# Altium schematic sheet IC304.schdoc
size 92 x 83 mm
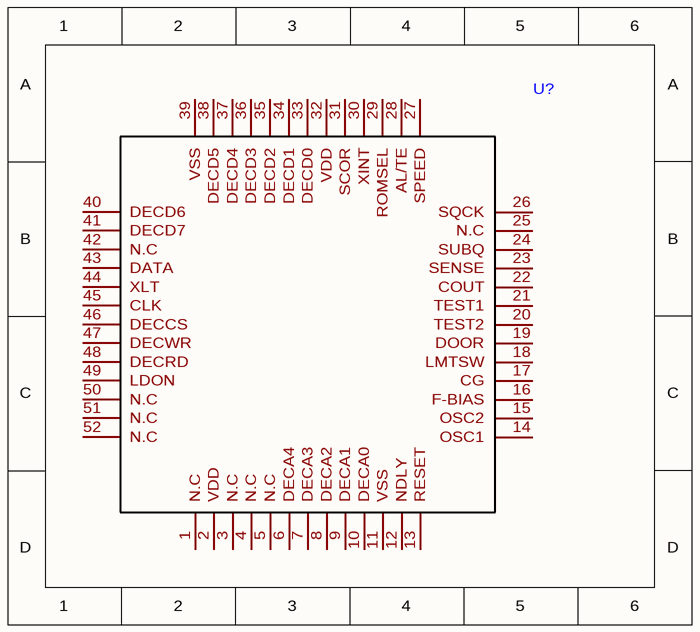
[diagram p0: IC304.schdoc]

## Parts
U?  (no value)  [LQFP-52_L10.0-W10.0-P0.65-LS12.0-BL]

## Nets

Not connected (* = marked no-connect by the designer): U? 1(N.C) 2(VDD) 3(N.C) 4(N.C) 5(N.C) 6(DECA4) 7(DECA3) 8(DECA2) 9(DECA1) 10(DECA0) 11(VSS) 12(NDLY) 13(RESET) 14(OSC1) 15(OSC2) 16(F-BIAS) 17(CG) 18(LMTSW) 19(DOOR) 20(TEST2) 21(TEST1) 22(COUT) 23(SENSE) 24(SUBQ) 25(N.C) 26(SQCK) 27(SPEED) 28(AL/TE) 29(ROMSEL) 30(XINT) 31(SCOR) 32(VDD) 33(DECD0) 34(DECD1) 35(DECD2) 36(DECD3) 37(DECD4) 38(DECD5) 39(VSS) 40(DECD6) 41(DECD7) 42(N.C) 43(DATA) 44(XLT) 45(CLK) 46(DECCS) 47(DECWR) 48(DECRD) 49(LDON) 50(N.C) 51(N.C) 52(N.C)

## Library data of the parts
U? = IC304